# Altium project knucke_tactile_feedback.PrjPcb
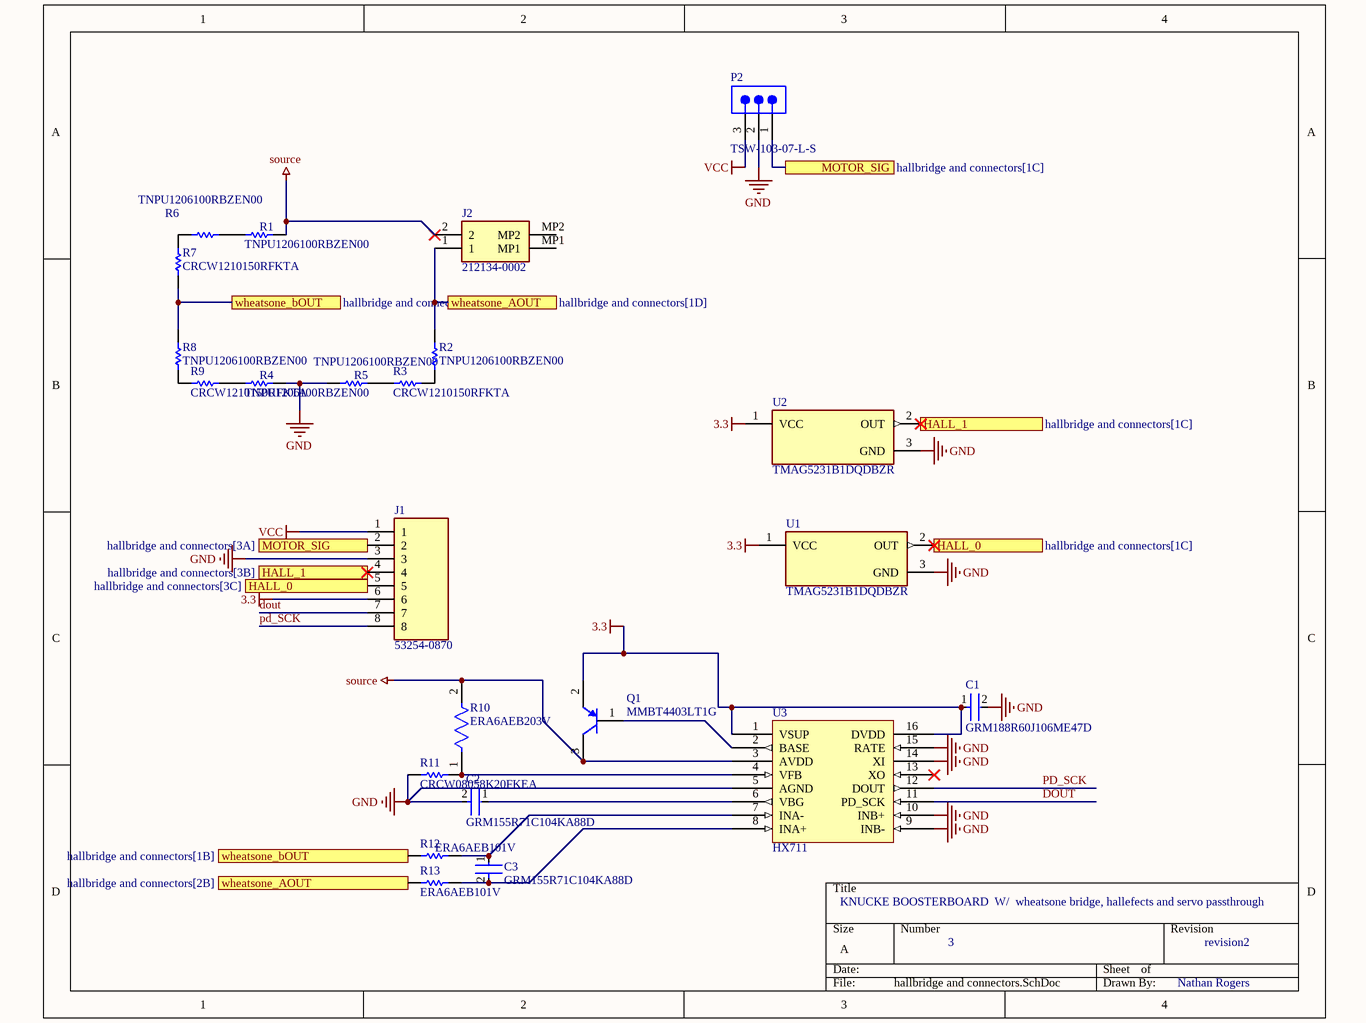
[diagram p0: hallbridge and connectors.SchDoc]
1 sheet, 23 parts. Net scope: flat (ports and power ports of the same name join across sheets).
Board file: PCB1.PcbDoc

## Sheet hallbridge and connectors.SchDoc
size A; SheetNumber: 1; SheetTotal: 1

### Parts
C1  GRM188R60J106ME47D  [FP-GRM188-0_1-e0_2_0_55-IPC_A]
C2  GRM155R71C104KA88D  [FP-GRM15-MFG]
C3  GRM155R71C104KA88D  [FP-GRM15-MFG]
J1  53254-0870  [SHDRRA8W50P0X200_1X8_1800X730X440P]
J2  212134-0002  [2121340002]
P2  TSW-103-07-L-S  [SMTC-TSW-103-07-X-S]
Q1  MMBT4403LT1G  [ONSC-SOT-23-3-318-08_V]
R1  TNPU1206100RBZEN00  [RESC3216X65X50ML15T25]
R2  TNPU1206100RBZEN00  [RESC3216X65X50ML15T25]
R3  CRCW1210150RFKTA  [RESC3225X60X45LL20T20]
R4  TNPU1206100RBZEN00  [RESC3216X65X50ML15T25]
R5  TNPU1206100RBZEN00  [RESC3216X65X50ML15T25]
R6  TNPU1206100RBZEN00  [RESC3216X65X50ML15T25]
R7  CRCW1210150RFKTA  [RESC3225X60X45LL20T20]
R8  TNPU1206100RBZEN00  [RESC3216X65X50ML15T25]
R9  CRCW1210150RFKTA  [RESC3225X60X45LL20T20]
R10  ERA6AEB203V  [FP-ERA6A-MFG]
R11  CRCW08058K20FKEA  [RESC2013X50X30NL20T20]
R12  ERA6AEB101V  [RESC2013X60X40ML20T25]
R13  ERA6AEB101V  [RESC2013X60X40ML20T25]
U1  TMAG5231B1DQDBZR  [FP-DBZ0003A-IPC_B]
U2  TMAG5231B1DQDBZR  [FP-DBZ0003A-IPC_B]
U3  HX711  [SOIC127P600X160-16N]

### Ports
HALL_0 (out, see hallbridge and connectors[1C]), HALL_0 (see hallbridge and connectors[3C]), HALL_1 (in, see hallbridge and connectors[3B]), HALL_1 (see hallbridge and connectors[1C]), MOTOR_SIG (see hallbridge and connectors[1C]), MOTOR_SIG (see hallbridge and connectors[3A]), wheatsone_AOUT (see hallbridge and connectors[1D]), wheatsone_AOUT (see hallbridge and connectors[2B]), wheatsone_bOUT (see hallbridge and connectors[1B]), wheatsone_bOUT (see hallbridge and connectors[1D])

### Nets
3.3: C1.1 J1.6 Q1.2(E) U1.1(VCC) U2.1(VCC) U3.1(VSUP) U3.16(DVDD)
GND: C1.2 C2.2 J1.3 P2.2 R4.2 R5.1 R11.1 U1.3(GND) U2.3(GND) U3.5(AGND) U3.9(INB-) U3.10(INB+) U3.14(XI) U3.15(RATE)
source: J2.2 Q1.3(C) R1.2 R10.2 U3.3(AVDD)
VCC: J1.1 P2.3
DOUT: J1.7 U3.11(PD_SCK)
PD_SCK: J1.8 U3.12(DOUT)
NetC2_1: C2.1 U3.6(VBG)
NetC3_1: C3.1 R12.2 U3.7(INA-)
NetC3_2: C3.2 R13.2 U3.8(INA+)
NetJ1_2: J1.2 P2.1 ; port MOTOR_SIG
NetJ1_4: J1.4 U2.2(OUT) ; port HALL_1
NetJ1_5: J1.5 U1.2(OUT) ; port HALL_0
NetJ2_1: J2.1 R2.2 R13.1 ; port wheatsone_AOUT
NetQ1_1: Q1.1(B) U3.2(BASE)
NetR1_1: R1.1 R6.2
NetR2_1: R2.1 R3.2
NetR3_1: R3.1 R5.2
NetR4_1: R4.1 R9.2
NetR6_1: R6.1 R7.2
NetR7_1: R7.1 R8.2 R12.1 ; port wheatsone_bOUT
NetR8_1: R8.1 R9.1
NetR10_1: R10.1 R11.2 U3.4(VFB)

Not connected (* = marked no-connect by the designer): J2 MP1 MP2; U3 13(XO)*

### Notes on the sheet
- KNUCKE BOOSTERBOARD  W/  wheatsone bridge, hallefects and servo passthrough
- 3
- revision2
- Nathan Rogers

### Library data of the parts
C1 = CMP-2006-02792-2: Chip Multilayer Ceramic Capacitors for General Purpose, 0603, 10uF, X5R, 15%, 20%, 6.3V; Packaging: Tape and Reel; Voltage Rating (DC): 6.3V; Width: 0.031inch; Termination: SMD/SMT; Dielectric: X5R; Package Quantity: 4000; Voltage Rating: 6.3V; Capacitance: 10uF; Case/Package: 0603; Min Operating Temperature: -55°C; Voltage: 6.3V; Length: 1.6mm; Thickness: 0.035inch; Lead Free: Lead Free; Depth: 0.8mm; Case Code (Imperial): 0603; Max Operating Temperature: 85°C; Material: Ceramic; Height: 0.8mm; Tolerance: 20%; Mount: Surface Mount; REACH SVHC: No SVHC; Radiation Hardening: No; Case Code (Metric): 1608
C2 C3 = CMP-2100-03641-2: CAP CER 0.1UF 16V X7R 0402; Manufacturer: Murata; Standoff Height: 0mm; Tolerance: 10%; Voltage Rating: 16Vdc; Material: Ceramic; Capacitance: 0.10μF; Value: 0.10μF; RoHS: TRUE; Manufacturer Part Number: GRM155R71C104KA88D; Temperature Characteristic: X7R; Octopart: https://octopart.com/grm155r71c104ka88d-murata-196880; Digikey Description: CAP CER 0.1UF 16V X7R 0402; Device Class L3: Ceramic Capacitors; Height: 0.55mm; ComponentLink2Description: Datasheet; Temperature Range Low: -55°C; Ipc Land Pattern Name: CAPC10050X219; ComponentLink2URL: https://search.murata.co.jp/Ceramy/image/img/A01X/G101/ENG/GRM155R71H471KA01-01A.pdf; Device Class L1: Passive Components; Lead Free: yes; Category: Cap; Package: GRM15; Temperature: -55°C to +125°C; Device Class L2: Capacitors; Temperature Range High: +125°C; Mouser Description: 0402 0.1 uF 16V ±10 % Tolerance X7R SMT Multilayer Ceramic Capacitor
J1 = CMP-003-000027-1: Headers & Wire Housings 8CKT WTB R/A; Manufacturer_Name: Molex; Geometry.Height: 4.4mm; Mouser Price/Stock: https://www.mouser.co.uk/ProductDetail/Molex/53254-0870?qs=s16%252Be%252B8QgeFQnKbK1eobMw%3D%3D; Mouser Part Number: 538-53254-0870; Source: 53254-0870.SchLib; Design Item ID: 53254-0870; Manufacturer_Part_Number: 53254-0870; Datasheet Link: https://componentsearchengine.com/Datasheets/2/53254-0870.pdf
J2 = CMP-003-000033-1: PICO-EZMATE PLUS1.0 PLUGASSY ETP LH 2CKT - Tape and Reel; Manufacturer_Name: Molex; Geometry.Height: 1.4mm; Datasheet Link: https://www.molex.com/pdm_docs/sd/2121340002_sd.pdf; Design Item ID: 212134-0002; Manufacturer_Part_Number: 212134-0002; Source: 212134-0002.SchLib; Mouser Price/Stock: https://www.mouser.co.uk/ProductDetail/Molex/212134-0002?qs=hd1VzrDQEGhMEPSgG43Vcg%3D%3D; Mouser Part Number: 538-212134-0002
P2 = CMP-1024-00334-1: 0.025" SQ Post Header, Through-hole, Vertical, -55 to 125 degC, 2.54 mm Pitch, 3-Pin, Male, RoHS; Manufacturer: Samtec; Pitch: 2.54 mm; Mounting Technology: Through-hole; ComponentLink2URL: http://www.samtec.com/documents/webfiles/pdf/TSW_TH.PDF; ComponentLink3Description: Package Specification; PackageVersion: DM, 8/1988; PartNumber: TSW-103-07-L-S; PackageReference: TSW-103-07-X-S; Orientation: Vertical; ComponentLink1URL: http://www.samtec.com; PackageDescription: .025[0.64] SQ. Post Terminal Strip Assembly; ComponentLink1Description: Manufacturer URL; ComponentLink2Description: Datasheet; ComponentLink3URL: http://www.samtec.com/documents/webfiles/cpdf/TSW-XXX-XX-XXX-X-XX-XXX-MKT.pdf; RoHS: True; DatasheetVersion: F-214; Temperature Range: -55 to 125 degC
Q1 = CMP-1048-00539-1: Switching Transistor, PNP Silicon, 3-Pin SOT-23, Pb-Free, Tape and Reel; Manufacturer: On Semiconductor; fT Min (MHz): 200; IC Continuous (A): -0.6; ComponentLink1URL: http://www.onsemi.com/; ComponentLink2URL: http://www.onsemi.cn/pub_link/Collateral/MMBT4403LT1-D.PDF; PackageVersion: Rev. AP, 11/2009; ComponentLink1Description: Manufacturer URL; PackageDescription: 3-Pin Small Outline Transistor, Body 2.92 x 1.3 mm, Pitch 0.95 mm; Polarity: PNP; ComponentLink3Description: Package Specification; DatasheetVersion: Rev. 12; Mounting Technology: Surface Mount; PackageReference: SOT-23-3-318-08; ComponentLink3URL: http://www.onsemi.cn/pub_link/Collateral/318-08.PDF; Packing: Tape and Reel; PartNumber: MMBT4403LT1G; RoHS: TRUE; ComponentLink2Description: Datasheet
R1 R2 R4-R6 R8 = CMP-2003-04597-1: Manufacturer: Vishay Dale; Part Number: TNPU1206100RBZEN00
R3 R7 R9 = CMP-2005-00637-1: Manufacturer: Vishay Dale; Part Number: CRCW1210150RFKTA
R10 = CMP-2001-00610-2: RES 20K OHM 0.1% 1/8W 0805; Power Rating: 125mW; Voltage Rating (DC): 100V; Resistance: 20kR; Temperature Coefficient: 25ppm/°C; REACH SVHC: No SVHC; Features: Automotive AEC-Q200; Tolerance: 0.1%; Size Code: 0805; Max Power Dissipation: 125mW; Termination: SMD/SMT; Package Quantity: 1; Resistor Type: Thin Film; Number of Pins: 2; Width: 1.25mm; Technology: THIN FILM; Min Operating Temperature: -55°C; Length: 2mm; Mount: Surface Mount; Height: 0.5mm; Resistance Tolerance: 0.1%; Military Standard: Not; Case Code (Imperial): 0805; Contact Plating: Tin; Case Code (Metric): 2012; Number of Terminations: 2; RoHS Compliant: Yes; Voltage Rating: 100V; Lead Free: Lead Free; Depth: 1.25mm; Construction: Rectangular; Case/Package: 0805; Radiation Hardening: No; Series: ERA-6A; Max Operating Temperature: 155°C; Packaging: Tape and Reel
R11 = CMP-2001-04148-1: Manufacturer: Vishay Dale; Part Number: CRCW08058K20FKEA
R12 R13 = CMP-2001-00580-1: Manufacturer: Panasonic; Part Number: ERA6AEB101V
U1 U2 = CMP-04937-000027-1: LOW-POWER, LOW-VOLTAGE (1.65 V T
U3 = CMP-002-000002-1: ADC, Delta-Sigma, 24-Bit, 1 Func, 2 Channel, Serial Access, PDSO16